# Altium schematic sheet Communication.SchDoc
size A4; SheetNumber: 4; SheetTotal: 5
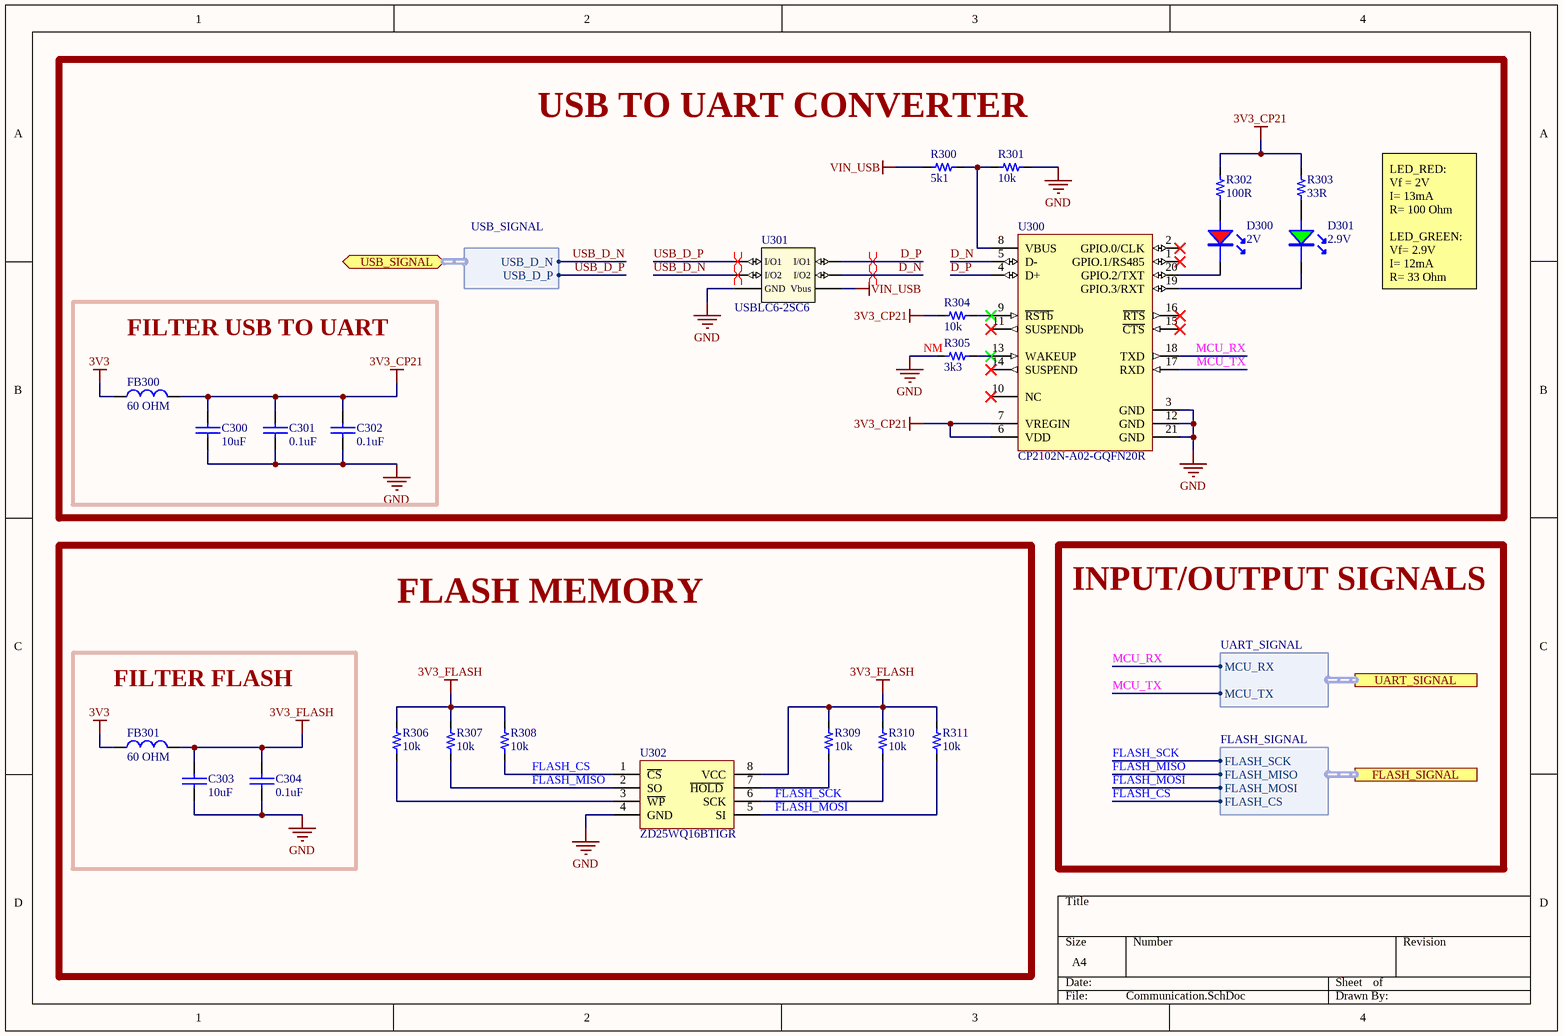
[diagram p0: Communication.SchDoc]

## Parts
C300  value 10uF  [0603_cap]  (hidden comment: 10uF 10V)
C301  value 0.1uF  [0603_cap]  (hidden comment: 0.1uF 50V)
C302  value 0.1uF  [0603_cap]  (hidden comment: 0.1uF 50V)
C303  value 10uF  [0603_cap]  (hidden comment: 10uF 10V)
C304  value 0.1uF  [0603_cap]  (hidden comment: 0.1uF 50V)
D300  2V  [0805_LED]
D301  2.9V  [0805_LED]
FB300  value 60 OHM  [0603_fb]  (hidden comment: 60OHM 2A)
FB301  value 60 OHM  [0603_fb]  (hidden comment: 60OHM 2A)
R300  value 5k1  [0603_res]  (hidden comment: 5k1 1/10W)
R301  value 10k  [0603_res]  (hidden comment: 10k 1/10W)
R302  value 100R  [0603_res]  (hidden comment: 100R 1/10W)
R303  value 33R  [0603_res]  (hidden comment: 33R 1/10W)
R304  value 10k  [0603_res]  (hidden comment: 10k 1/10W)
R305  value 3k3  Usage: NM  [0603_res]  (hidden comment: 3k3 1/10W)
R306  value 10k  [0603_res]  (hidden comment: 10k 1/10W)
R307  value 10k  [0603_res]  (hidden comment: 10k 1/10W)
R308  value 10k  [0603_res]  (hidden comment: 10k 1/10W)
R309  value 10k  [0603_res]  (hidden comment: 10k 1/10W)
R310  value 10k  [0603_res]  (hidden comment: 10k 1/10W)
R311  value 10k  [0603_res]  (hidden comment: 10k 1/10W)
U300  CP2102N-A02-GQFN20R  [WFQFN_20_EP_3X3MM]
U301  USBLC6-2SC6  [SOT_23_6]
U302  ZD25WQ16BTIGR  [SOIC_8_3.9mm]

## Blocks framed on the sheet
USB TO UART CONVERTER: D300 D301 R300-R305 U300 U301
FILTER USB TO UART: C300-C302 FB300
FLASH MEMORY: R306-R311 U302
FILTER FLASH: C303 C304 FB301

## Ports
FLASH_SIGNAL (harness FLASH_SIGNAL, see main[3B], MCU[4B]), UART_SIGNAL (harness UART_SIGNAL, see main[3B], MCU[4D]), USB_SIGNAL (bidir, harness USB_SIGNAL, see main[3B], Power[2A])

## Harnesses
USB_SIGNAL: USB_D_N, USB_D_P
UART_SIGNAL: MCU_TX, MCU_RX
FLASH_SIGNAL: FLASH_SCK, FLASH_MISO, FLASH_MOSI, FLASH_CS

## Nets
3V3: FB300.1 FB301.2
3V3_CP21: C300.1 C301.1 C302.1 FB300.2 R302.2 R303.2 R304.1 U300.6(VDD) U300.7(VREGIN)
3V3_FLASH: C303.1 C304.1 FB301.1 R306.2 R307.2 R308.1 R309.2 R310.2 R311.2 U302.8(VCC)
GND: C300.2 C301.2 C302.2 C303.2 C304.2 R301.2 R305.1 U300.3(GND) U300.12(GND) U300.21(GND) U301.2(GND) U302.4(GND)
VIN_USB: R300.1 U301.5(Vbus)
D_N: U300.5(D-) U301.4(I/O2)
D_P: U300.4(D+) U301.6(I/O1)
FLASH_CS: R308.2 U302.1(~{CS}) ; port FLASH_SIGNAL.FLASH_CS
FLASH_MISO: R307.1 U302.2(SO) ; port FLASH_SIGNAL.FLASH_MISO
FLASH_MOSI: R311.1 U302.5(SI) ; port FLASH_SIGNAL.FLASH_MOSI
FLASH_SCK: R310.1 U302.6(SCK) ; port FLASH_SIGNAL.FLASH_SCK
MCU_RX: U300.18(TXD) ; port UART_SIGNAL.MCU_RX
MCU_TX: U300.17(RXD) ; port UART_SIGNAL.MCU_TX
USB_D_N: U301.3(I/O2) ; port USB_SIGNAL.USB_D_N
USB_D_P: U301.1(I/O1) ; port USB_SIGNAL.USB_D_P
NetD300_1: D300.1(A) R302.1
NetD300_2: D300.2 U300.20(GPIO.2/TXT)
NetD301_1: D301.1(A) R303.1
NetD301_2: D301.2 U300.19(GPIO.3/RXT)
NetR300_2: R300.2 R301.1 U300.8(VBUS)
NetR304_2: R304.2 U300.9(~{RSTb})
NetR305_2: R305.2 U300.13(WAKEUP)
NetR306_1: R306.1 U302.3(~{WP})
NetR309_1: R309.1 U302.7(~{HOLD})

Not connected (* = marked no-connect by the designer): U300 1(GPIO.1/RS485)* 2(GPIO.0/CLK)* 10(NC)* 11(SUSPENDb)* 14(SUSPEND)* 15(~{CTS})* 16(~{RTS})*

## Layout directives
differential pair: D_N, D_P, USB_D_N, USB_D_P

## Notes on the sheet
- LED_RED:
  Vf = 2V
  I= 13mA
  R= 100 Ohm
  LED_GREEN:
  Vf= 2.9V
  I= 12mA
  R= 33 Ohm
- INPUT/OUTPUT SIGNALS

## Library data of the parts
C300 C303 = Cap_10uF_0603_10V: 10V 10uF X5R ±10% 0603 Multilayer Ceramic Capacitors MLCC - SMD/SMT ROHS; Manufacturer: CCTC; Manufacturer Part Number: TCC0603X5R106K100CT; Supplier 1: LCSC; Supplier Part Number 1: C380314; ComponentLink1Description: LCSC; ComponentLink1URL: https://www.lcsc.com/product-detail/Multilayer-Ceramic-Capacitors-MLCC-SMD-SMT_CCTC-TCC0603X5R106K100CT_C380314.html
C301 C302 C304 = Cap_0.1uF_0603_50V: 50V 100nF Y5V -20%~+80% 0603 Multilayer Ceramic Capacitors MLCC - SMD/SMT ROHS; Manufacturer: Walsin Tech Corp; Manufacturer Part Number: 0603F104Z500CT; Supplier 1: LCSC; Supplier Part Number 1: C83060; ComponentLink1Description: LCSC; ComponentLink1URL: https://www.lcsc.com/product-detail/Multilayer-Ceramic-Capacitors-MLCC-SMD-SMT_Walsin-Tech-Corp-0603F104Z500CT_C83060.html
D300 = LED_0805_RED: LED RED CLEAR 0805 SMD; Manufacturer: XINGLIGHT; Manufacturer Part Number: XL-2012SURC; Supplier 1: LCSC; Supplier Part Number 1: C965812; ComponentLink1Description: LCSC; ComponentLink1URL: https://www.lcsc.com/product-detail/Light-Emitting-Diodes-LED_XINGLIGHT-XL-2012SURC_C965812.html
D301 = LED_0805_Green: LED GREEN CLEAR 0805 SMD; Manufacturer: XINGLIGHT; Manufacturer Part Number: XL-2012UGC; Supplier 1: LCSC; Supplier Part Number 1: C965815; ComponentLink1Description: LCSC; ComponentLink1URL: https://www.lcsc.com/product-detail/Light-Emitting-Diodes-LED_XINGLIGHT-XL-2012UGC_C965815.html
FB300 FB301 = FB_60_0603_2A: 2A 1 100mΩ 60Ω@100MHz ±25% 0603 Ferrite Beads ROHS; Manufacturer: TAI-TECH; Manufacturer Part Number: HCB1608KF-600T20; ComponentLink1Description: LCSC; ComponentLink1URL: https://www.lcsc.com/product-detail/Ferrite-Beads_TAI-TECH-HCB1608KF-600T20_C369516.html; Supplier 1: LCSC; Supplier Part Number 1: C369516
R300 = Res_5k1_0603_1/10W: RES SMD 5k1 OHM 5% 1/10W 0603; Manufacturer: FOJAN; Manufacturer Part Number: FRC0603J512 TS; ComponentLink1URL: https://www.lcsc.com/product-detail/Chip-Resistor-Surface-Mount_FOJAN-FRC0603J512-TS_C2907114.html; Supplier 1: LCSC; Supplier Part Number 1: C2907114; ComponentLink1Description: LCSC
R301 R304 R306-R311 = Res_10k_0603_1/10W: RES SMD 10k OHM 5% 1/10W 0603; Manufacturer: FOJAN; Manufacturer Part Number: FRC0603J103TS; ComponentLink1URL: https://www.lcsc.com/product-detail/Chip-Resistor-Surface-Mount_FOJAN-FRC0603J103TS_C2930027.html; Supplier 1: LCSC; Supplier Part Number 1: C2930027; ComponentLink1Description: LCSC
R302 = Res_100R_0603_1/10W: RES SMD 100R OHM 5% 1/10W 0603; Manufacturer: FOJAN; Manufacturer Part Number: FRC0603J101 TS; ComponentLink1URL: https://www.lcsc.com/product-detail/Chip-Resistor-Surface-Mount_FOJAN-FRC0603J101-TS_C2907089.html; Supplier 1: LCSC; Supplier Part Number 1: C2907089; ComponentLink1Description: LCSC
R303 = Res_33R_0603_1/10W: RES SMD 33R OHM 5% 1/10W 0603; Manufacturer: FOJAN; Manufacturer Part Number: FRC0603J330 TS; ComponentLink1URL: https://www.lcsc.com/product-detail/Chip-Resistor-Surface-Mount_FOJAN-FRC0603J330-TS_C2907154.html; Supplier 1: LCSC; Supplier Part Number 1: C2907154; ComponentLink1Description: LCSC
R305 = Res_3k3_0603_1/10W: RES SMD 3k3 OHM 5% 1/10W 0603; Manufacturer: FOJAN; Manufacturer Part Number: FRC0603J332 TS; ComponentLink1URL: https://www.lcsc.com/product-detail/Chip-Resistor-Surface-Mount_FOJAN-FRC0603J332-TS_C2907140.html; Supplier 1: LCSC; Supplier Part Number 1: C2907140; ComponentLink1Description: LCSC
U300 = IC_SGL_USB2UART-BRIDGE_20QFN: IC USB TO UART BRIDGE QFN20; Manufacturer: Silicon Labs; Manufacturer Part Number: CP2102N-A02-GQFN20R; Supplier 1: LCSC; Supplier Part Number 1: C969913; ComponentLink1Description: LCSC; ComponentLink1URL: https://www.lcsc.com/product-detail/USB-ICs_SILICON-LABS-CP2102N-A02-GQFN20R_C969913.html
U301 = TVS_5.25V_2CH_SOT_23_6: TVS DIODE 5.25V 17V SOT23-6; Manufacturer: STMicroelectronics; ComponentLink1Description: LCSC; ComponentLink1URL: https://www.lcsc.com/product-detail/ESD-Protection-Devices_STMicroelectronics-USBLC6-2SC6_C7519.html; Supplier 1: LCSC; Manufacturer Part Number: USBLC6-2SC6; Supplier Part Number 1: C7519
U302 = IC_FLASH_ZD25WQ16BTIGR_8SOP: IC FLASH 16M SPI 85MHZ 8SOP; Manufacturer: Zetta; Manufacturer Part Number: ZD25WQ16BTIGR; Supplier 1: LCSC; Supplier Part Number 1: C2896790; ComponentLink1Description: LCSC; ComponentLink1URL: https://www.lcsc.com/product-detail/NOR-FLASH_Zetta-ZD25WQ16BTIGR_C2896790.html